# Altium schematic sheet NEW-AQB-5-ANTON_TRANS-PWR_MotionController.SchDoc: Motion Controller Interface
size A3; Author: Ryan Jones; CompanyName: AQRONOS; DrawnBy: Ryan Jones; Engineer: Ryan Jones; Organization: AQRONOS; DocumentNumber: AQB-2; Revision: RC01; SheetNumber: 1; SheetTotal: 1
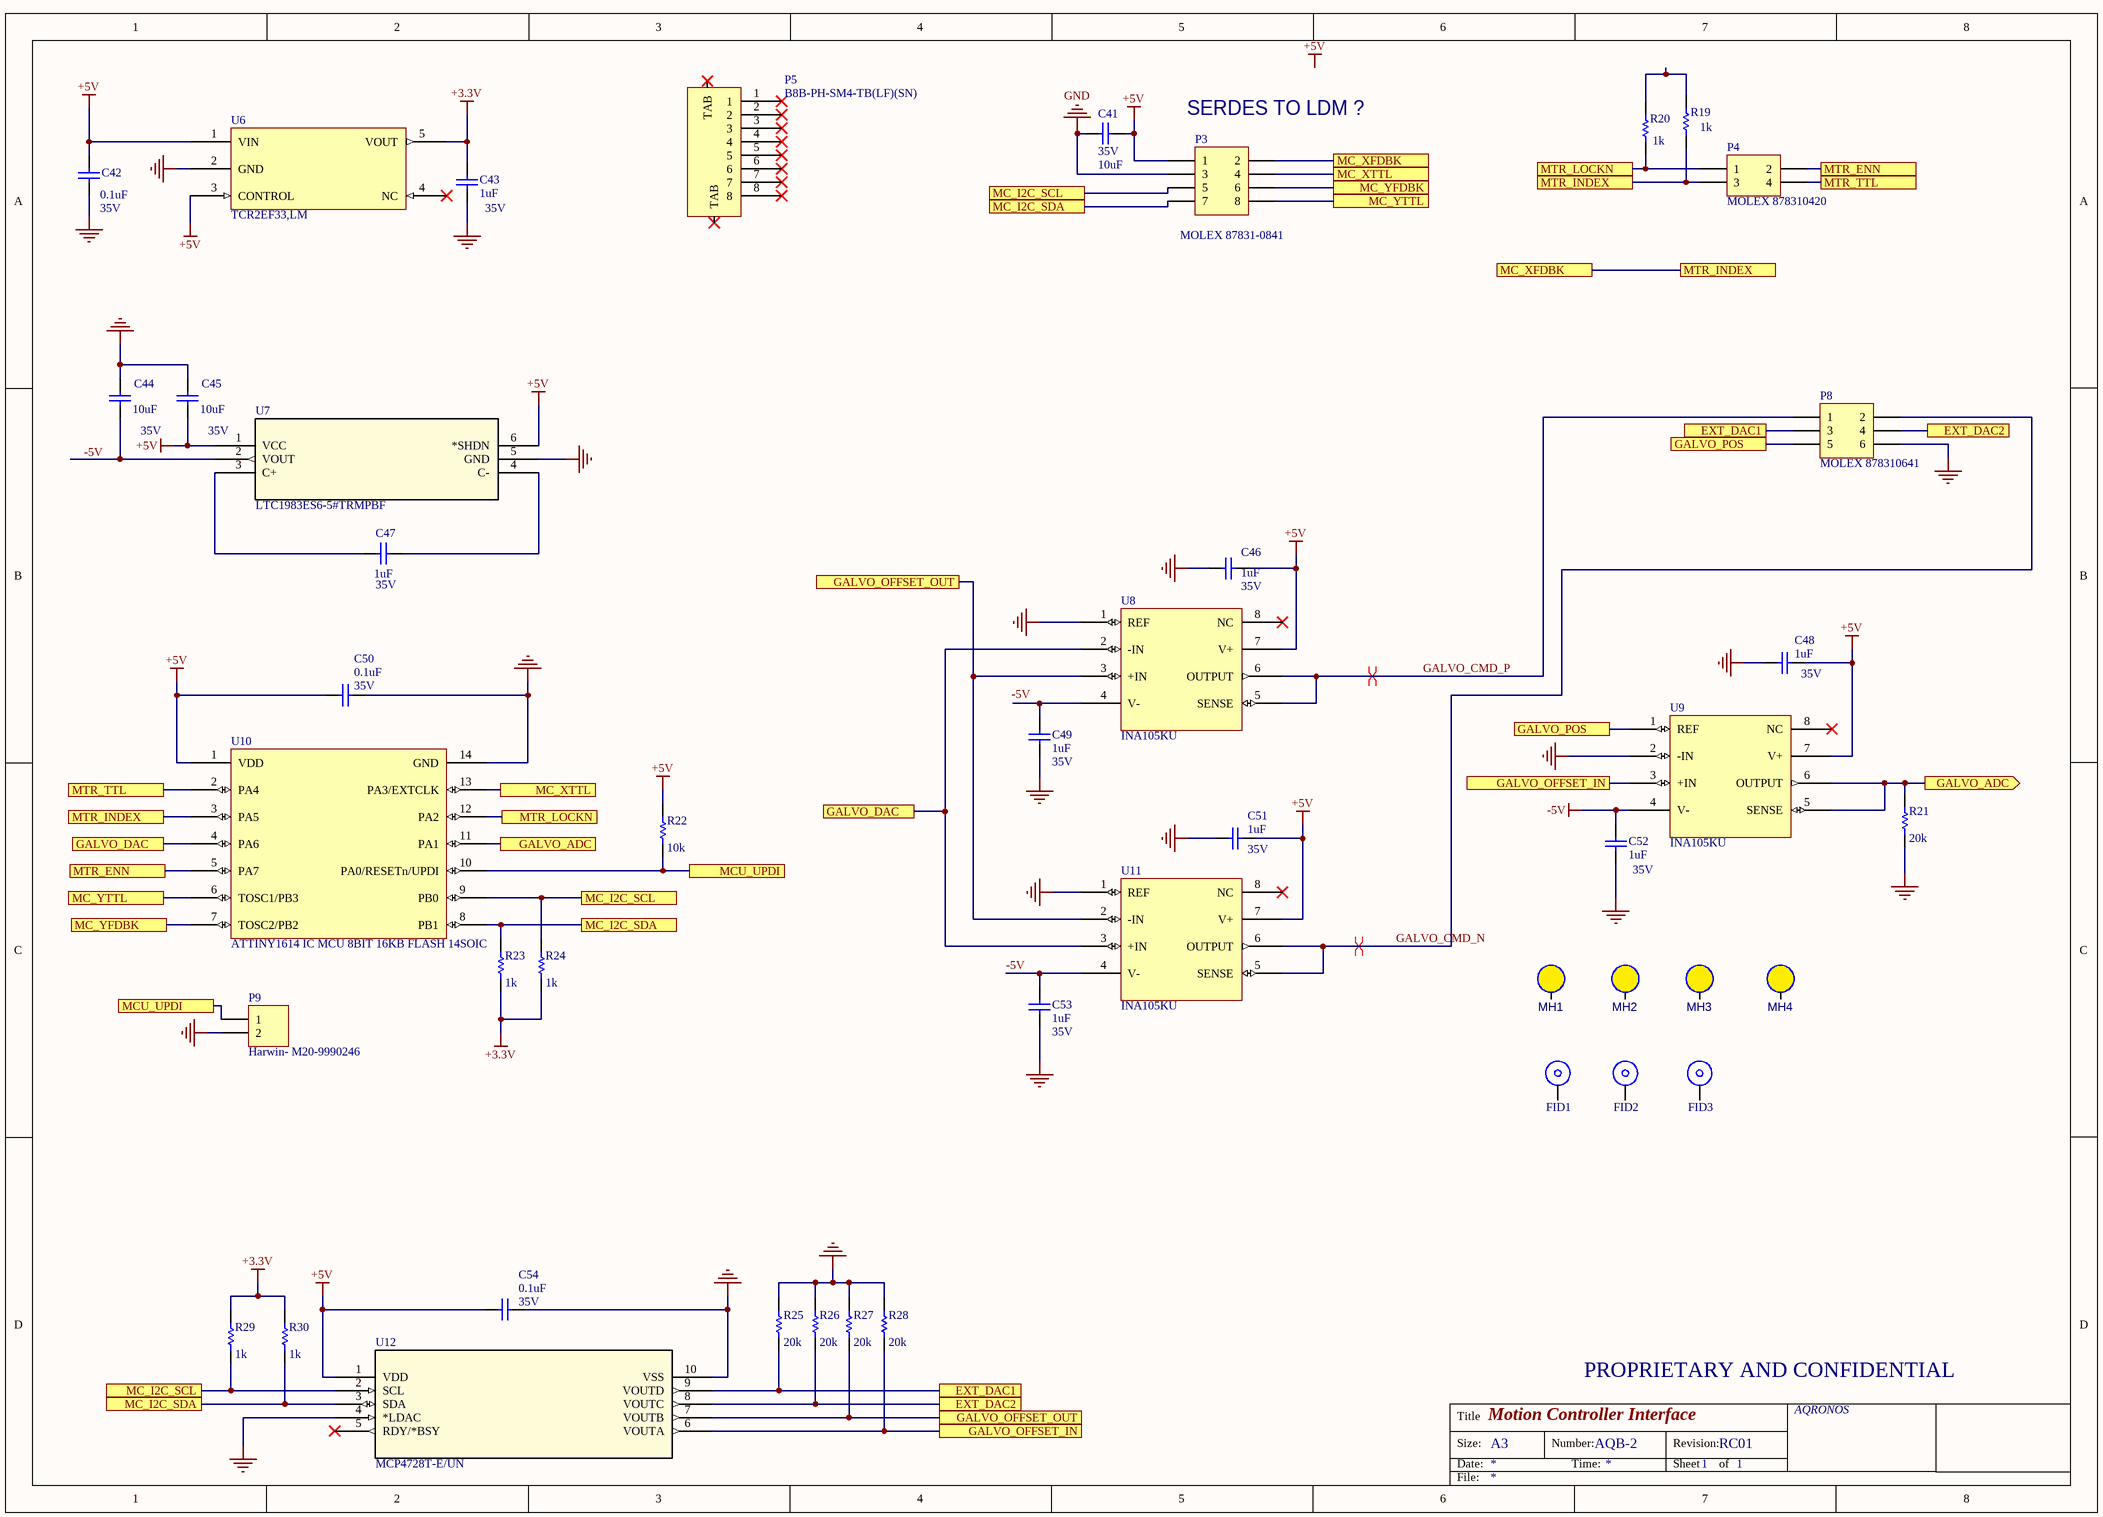
[diagram p0: NEW-AQB-5-ANTON_TRANS-PWR_MotionController.SchDoc]

## Parts
C41  value 10uF  Voltage: 35V  [CAP1206]  (hidden comment: Capacitor_non_pol)
C42  value 0.1uF  Voltage: 35V  [CAP0402]  (hidden comment: Capacitor_non_pol)
C43  value 1uF  Voltage: 35V  [CAP0402]  (hidden comment: Capacitor_non_pol)
C44  value 10uF  Voltage: 35V  [CAP1206]  (hidden comment: Capacitor_non_pol)
C45  value 10uF  Voltage: 35V  [CAP1206]  (hidden comment: Capacitor_non_pol)
C46  value 1uF  Voltage: 35V  [CAP0402]  (hidden comment: Capacitor_non_pol)
C47  value 1uF  Voltage: 35V  [CAP0402]  (hidden comment: Capacitor_non_pol)
C48  value 1uF  Voltage: 35V  [CAP0402]  (hidden comment: Capacitor_non_pol)
C49  value 1uF  Voltage: 35V  [CAP0402]  (hidden comment: Capacitor_non_pol)
C50  value 0.1uF  Voltage: 35V  [CAP0402]  (hidden comment: Capacitor_non_pol)
C51  value 1uF  Voltage: 35V  [CAP0402]  (hidden comment: Capacitor_non_pol)
C52  value 1uF  Voltage: 35V  [CAP0402]  (hidden comment: Capacitor_non_pol)
C53  value 1uF  Voltage: 35V  [CAP0402]  (hidden comment: Capacitor_non_pol)
C54  value 0.1uF  Voltage: 35V  [CAP0402]  (hidden comment: Capacitor_non_pol)
FID1  FIDUCIAL  [FID]  (value not drawn)
FID2  FIDUCIAL  [FID]  (value not drawn)
FID3  FIDUCIAL  [FID]  (value not drawn)
MH1  PAD-MH  [PAD-135Mils]  (value not drawn)
MH2  PAD-MH  [PAD-135Mils]  (value not drawn)
MH3  PAD-MH  [PAD-135Mils]  (value not drawn)
MH4  PAD-MH  [PAD-135Mils]  (value not drawn)
P3  MOLEX 87831-0841  [HDR4X2-Molex]
P4  MOLEX 878310420  [HDR2X2-Molex]
P5  B8B-PH-SM4-TB(LF)(SN)  [B8B-PH-SM4-TB(LF)(SN)]
P8  MOLEX 878310641  [HDR3X2-Molex]
P9  Harwin- M20-9990246  [HDR1X2]
R19  value 1k  [RES0402]  (hidden comment: Resistor)
R20  value 1k  [RES0402]  (hidden comment: Resistor)
R21  value 20k  [RES0402]  (hidden comment: Resistor)
R22  value 10k  [RES0402]  (hidden comment: Resistor)
R23  value 1k  [RES0402]  (hidden comment: Resistor)
R24  value 1k  [RES0402]  (hidden comment: Resistor)
R25  value 20k  [RES0402]  (hidden comment: Resistor)
R26  value 20k  [RES0402]  (hidden comment: Resistor)
R27  value 20k  [RES0402]  (hidden comment: Resistor)
R28  value 20k  [RES0402]  (hidden comment: Resistor)
R29  value 1k  [RES0402]  (hidden comment: Resistor)
R30  value 1k  [RES0402]  (hidden comment: Resistor)
U6  TCR2EF33,LM  [SOT-753]
U7  LTC1983ES6-5#TRMPBF  [SOT-23-6]
U8  INA105KU  [SOIC8]
U9  INA105KU  [SOIC8]
U10  ATTINY1614 IC MCU 8BIT 16KB FLASH 14SOIC  [SOIC14]
U11  INA105KU  [SOIC8]
U12  MCP4728T-E/UN  [MSOP10]

## Ports
EXT_DAC1, EXT_DAC2, GALVO_ADC, GALVO_ADC (out), GALVO_DAC, GALVO_OFFSET_IN, GALVO_OFFSET_OUT, GALVO_POS, MC_I2C_SCL, MC_I2C_SDA, MC_XFDBK, MC_XTTL, MC_YFDBK, MC_YTTL, MCU_UPDI, MTR_ENN, MTR_INDEX, MTR_LOCKN, MTR_TTL

## Nets
+3.3V: C43.1 R23.1 R24.1 R29.2 R30.2 U6.5(VOUT)
+5V: C41.2 C42.1 C45.2 C46.2 C48.2 C50.2 C51.2 C54.2 P3.1 R22.2 U6.1(VIN) U6.3(CONTROL) U7.1(VCC) U7.6(*SHDN) U8.7(V+) U9.7(V+) U10.1(VDD) U11.7(V+) U12.1(VDD)
-5V: C52.1 C53.1 U9.4(V-) U11.4(V-)
GND: C41.1 C42.2 C43.2 C44.1 C45.1 C46.1 C48.1 C49.2 C50.1 C51.1 C52.2 C53.2 C54.1 P3.3 P8.6 P9.2 R21.1 R25.2 R26.2 R27.2 R28.2 U6.2(GND) U7.5(GND) U8.1(REF) U9.2(-IN) U10.14(GND) U11.1(REF) U12.4(*LDAC) U12.10(VSS)
EXT_DAC1: P8.3 R25.1 U12.9(VOUTD) ; port EXT_DAC1
EXT_DAC2: P8.4 R26.1 U12.8(VOUTC) ; port EXT_DAC2
GALVO_ADC: R21.2 U9.5(SENSE) U9.6(OUTPUT) U10.11(PA1) ; port GALVO_ADC
GALVO_CMD_N: P8.2 U11.5(SENSE) U11.6(OUTPUT)
GALVO_CMD_P: P8.1 U8.5(SENSE) U8.6(OUTPUT)
GALVO_DAC: U8.2(-IN) U10.4(PA6) U11.3(+IN) ; port GALVO_DAC
GALVO_OFFSET_IN: R28.1 U9.3(+IN) U12.6(VOUTA) ; port GALVO_OFFSET_IN
GALVO_OFFSET_OUT: R27.1 U8.3(+IN) U11.2(-IN) U12.7(VOUTB) ; port GALVO_OFFSET_OUT
GALVO_POS: P8.5 U9.1(REF) ; port GALVO_POS
MC_I2C_SCL: P3.5 R24.2 R29.1 U10.9(PB0) U12.2(SCL) ; port MC_I2C_SCL
MC_I2C_SDA: P3.7 R23.2 R30.1 U10.8(PB1) U12.3(SDA) ; port MC_I2C_SDA
MC_XFDBK: P3.2 P4.3 R19.1 U10.3(PA5) ; port MTR_INDEX, port MC_XFDBK
MC_XTTL: P3.4 U10.13(PA3/EXTCLK) ; port MC_XTTL
MC_YFDBK: P3.6 U10.7(TOSC2/PB2) ; port MC_YFDBK
MC_YTTL: P3.8 U10.6(TOSC1/PB3) ; port MC_YTTL
MCU_UPDI: P9.1 R22.1 U10.10(PA0/RESETn/UPDI) ; port MCU_UPDI
MTR_ENN: P4.2 U10.5(PA7) ; port MTR_ENN
MTR_LOCKN: P4.1 R20.1 U10.12(PA2) ; port MTR_LOCKN
MTR_TTL: P4.4 U10.2(PA4) ; port MTR_TTL
NetC44_2: C44.2 U7.2(VOUT)
NetC47_1: C47.1 U7.3(C+)
NetC47_2: C47.2 U7.4(C-)
NetC49_1: C49.1 U8.4(V-)
NetR19_2: R19.2 R20.2

Not connected (* = marked no-connect by the designer): MH1 1; MH2 1; MH3 1; MH4 1; P5 1* 2* 3* 4* 5* 6* 7* 8* TAB*; U6 4(NC)*; U8 8(NC)*; U9 8(NC)*; U11 8(NC)*; U12 5(RDY/*BSY)*

## Layout directives
differential pair: GALVO_CMD_N, GALVO_CMD_P

## Notes on the sheet
- (near P3) SERDES TO LDM ?
- PROPRIETARY AND CONFIDENTIAL
- Labels drawn without touching a wire or pin: +5V, -5V
- Title
- Size:
- Date:
- A3
- Number:
- Time:
- Revision:
- Sheet
- of
- File:

## Library data of the parts
C41 C44 C45 = Capacitor_non_pol: Manufacturer Part Number: CGA5L1X7R1V106K160AC; Vendor Part Number: *; Footprint: *; P/N: *; Tolerance: *; Vendor: *; Manufacturer: *; Power: *; Current: *
C42 C50 C54 = Capacitor_non_pol: Manufacturer Part Number: GMK107B7104KAHT; Vendor Part Number: *; Footprint: 0402; P/N: *; Tolerance: *; Vendor: *; Manufacturer: *; Power: *; Current: *
C43 C46-C49 C51-C53 = Capacitor_non_pol: Manufacturer Part Number: GMK107AB7105KAHT; Vendor Part Number: *; Footprint: *; P/N: *; Tolerance: *; Vendor: *; Manufacturer: *; Power: *; Current: *
FID1-FID3 = FID
MH1-MH4 = PAD-MH: PAD,MOUNTING HOLE
P3 = HDR4x2-87831-0841: Connector Header Through Hole 8 position 0.079" (2.00mm); Manufacturer Part Number: 0878310841; Digi-Key Part Number: WM8611-ND; Footprint: HDR4x2-Molex; P/N: *; Tolerance: *; Value: *; Vendor: Molex
P4 = HDR2x2-878310420: Connector Header Through Hole 4 position 0.079" (2.00mm); Manufacturer Part Number: 87831-0420; Digi-Key Part Number: WM18557-ND; Footprint: HDR2x2-Molex; P/N: *; Tolerance: *; Value: *; Vendor: Molex
P5 = B8B-PH-SM4-TB(LF)(SN): 8 PIN JST SMT 2.0 MM PITCH
P8 = HDR3x2-878310641: Connector Header Through Hole 6 position 0.079" (2.00mm); Digi-Key Part Number: WM3590-ND; Footprint: HDR3x2-Molex; Manufacturer Part Number: 878310641; P/N: *; Tolerance: *; Value: *; Vendor: Molex
P9 = HDR1x2-M20-9990246: Connector Header Through Hole 2 position 0.100" (2.54mm); Vendor: Harwin Inc.; Digi-Key Part Number: 952-2262-ND; Footprint: HDR1x2; Manufacturer Part Number: M20-9990246; Tolerance: *; Value: *
R19 R20 R23 R24 R29 R30 = Resistor: Manufacturer Part Number: ERJ-2GEJ102X; Digi-Key Part Number: *; Footprint: *; HelpURL: *; P/N: *; Tolerance: *; Vendor: *; Voltage: *; Power: *; Current: *
R21 R25-R28 = Resistor: Manufacturer Part Number: ERJ-2RKF2002X; Digi-Key Part Number: *; Footprint: *; HelpURL: *; P/N: *; Tolerance: *; Vendor: *; Voltage: *; Power: *; Current: *
R22 = Resistor: Manufacturer Part Number: ERJ-2GEJ103X; Digi-Key Part Number: *; Footprint: *; HelpURL: *; P/N: *; Tolerance: *; Vendor: *; Voltage: *; Power: *; Current: *
U6 = TCR2EF33,LM: Linear Voltage Regulator IC Positive Fixed 1 Output 200mA SMV; Manufacturer Part Number: TCR2EF33,LM(CT; Vendor: Toshiba Semiconductor and Storage; P/N: *; HelpURL: *; Tolerance: *; Value: *; Digikey Part Number: TCR2EF33LM(CTTR-ND
U7 = LTC1983ES6-5#TRM: Charge Pump Switching Regulator IC Negative Fixed -5V 1 Output 100mA SOT-23-6 Thin, TSOT-23-6; Vendor: Linear Technology/Analog Devices; Manufacturer Part Number: LTC1983ES6-5#TRMPBF; Value: *; Digi-Key Part Number: LTC1983ES6-5#TRMPBFTR-ND; HelpURL: *; P/N: *; Footprint: SOT-23_S6; Tolerance: *
U8 U9 U11 = INA105: IC OPAMP DIFFERENTIAL 1MHZ 8SOIC; Vendor: Texas Instruments; Tolerance: *; Value: *; Voltage: *; Digi-Key Part Number: 296-44407-5-ND; Manufacturer Part Number: INA105KU
U10 = ATTINY1614-SSFR: AVR tinyAVR™ 1 Microcontroller IC 8-Bit 20MHz 16KB (16K x 8) FLASH 14-SOIC; Vendor: Microchip Technology; Value: *; P/N: *; Tolerance: *; HelpURL: *; Digi-Key Part Number: ATTINY1614-SSFRCT-ND; Manufacturer Part Number: ATTINY1614-SSFR
U12 = MCP4728T-E/UN: 12 Bit Digital to Analog Converter 4 10-MSOP; Vendor: Microchip Technology; Manufacturer Part Number: MCP4728T-E/UN; Value: *; Digi-Key Part Number: MCP4728T-E/UNTR-ND; P/N: *; Tolerance: *